# Altium schematic sheet power_distribution.SchDoc
size A4
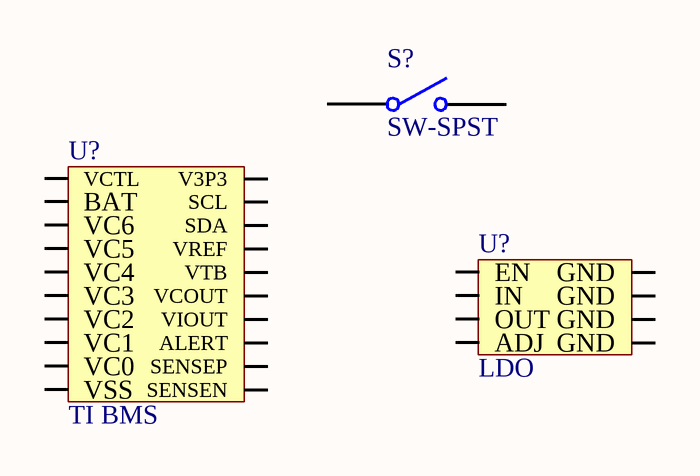
[diagram p0: power_distribution.SchDoc]

## Parts
(Parts that share a designator on the sheet are numbered #1, #2 ... from top to bottom, then left to right.)
S?  SW-SPST  [SPST-2]
U?#1  TI BMS  [TSOP65P640X120-20N]
U?#2  LDO  [SOIC127P600X170-8N]

## Nets

Not connected (* = marked no-connect by the designer): S? 1(COMMON) 2(NO); U?#1 ALERT BAT SCL SDA SENSEN SENSEP V3P3 VC0 VC1 VC2 VC3 VC4 VC5 VC6 VCOUT VCTL VIOUT VREF VSS VTB; U?#2 ADJ/BYP(ADJ) EN GND IN OUT

## Library data of the parts
S? = SW-SPST: Single-Pole, Single-Throw Switch; Published: 24-Mar-1999; LatestRevisionDate: 17-Jul-2002; LatestRevisionNote: Re-released for DXP Platform.; PackageReference: SPST-2; Publisher: Altium Limited; PackageDescription: Switch; 2 Leads
U?#1 U?#2 = U?